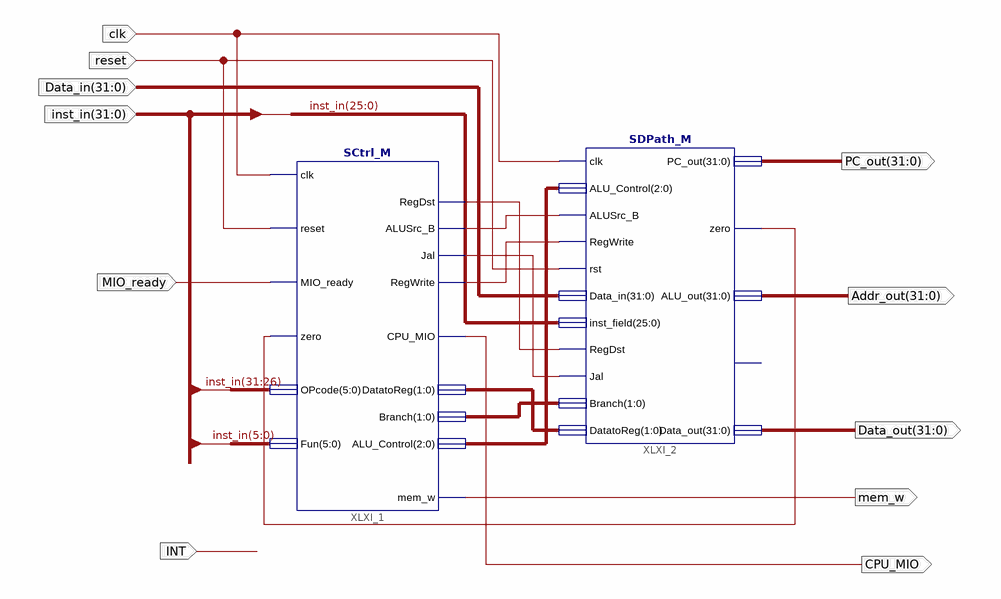
[diagram p0: schematic sheet 1]
// Xilinx ISE schematic SCPU_M.sch (kintex7) as structural Verilog: 2 symbols, 11 ports
module SCPU_M (
  input  MIO_ready,
  input  INT,
  input  clk,
  input  reset,
  input  [31:0] Data_in,
  input  [31:0] inst_in,
  output [31:0] Data_out,
  output [31:0] Addr_out,
  output [31:0] PC_out,
  output mem_w,
  output CPU_MIO
);

  wire XLXN_15, XLXN_20, XLXN_21, XLXN_22, XLXN_23;
  wire [1:0] XLXN_25, XLXN_26;
  wire [2:0] XLXN_24;

  SCtrl_M XLXI_1 (
    .clk(clk), .reset(reset), .MIO_ready(MIO_ready), .zero(XLXN_15), .OPcode(inst_in[31:26]),
    .Fun(inst_in[5:0]), .RegDst(XLXN_20), .ALUSrc_B(XLXN_21), .Jal(XLXN_22), .RegWrite(XLXN_23),
    .CPU_MIO(CPU_MIO), .DatatoReg(XLXN_26), .Branch(XLXN_25), .ALU_Control(XLXN_24), .mem_w(mem_w));
  SDPath_M XLXI_2 (
    .clk(clk), .ALU_Control(XLXN_24), .ALUSrc_B(XLXN_21), .RegWrite(XLXN_23), .rst(reset), .Data_in(Data_in),
    .inst_field(inst_in[25:0]), .RegDst(XLXN_20), .Jal(XLXN_22), .Branch(XLXN_25), .DatatoReg(XLXN_26),
    .PC_out(PC_out), .zero(XLXN_15), .ALU_out(Addr_out), .Data_out(Data_out));  // open: overflow
endmodule
